# Altium schematic sheet Sensor.SchDoc
size A3; SheetNumber: 7; SheetTotal: 7
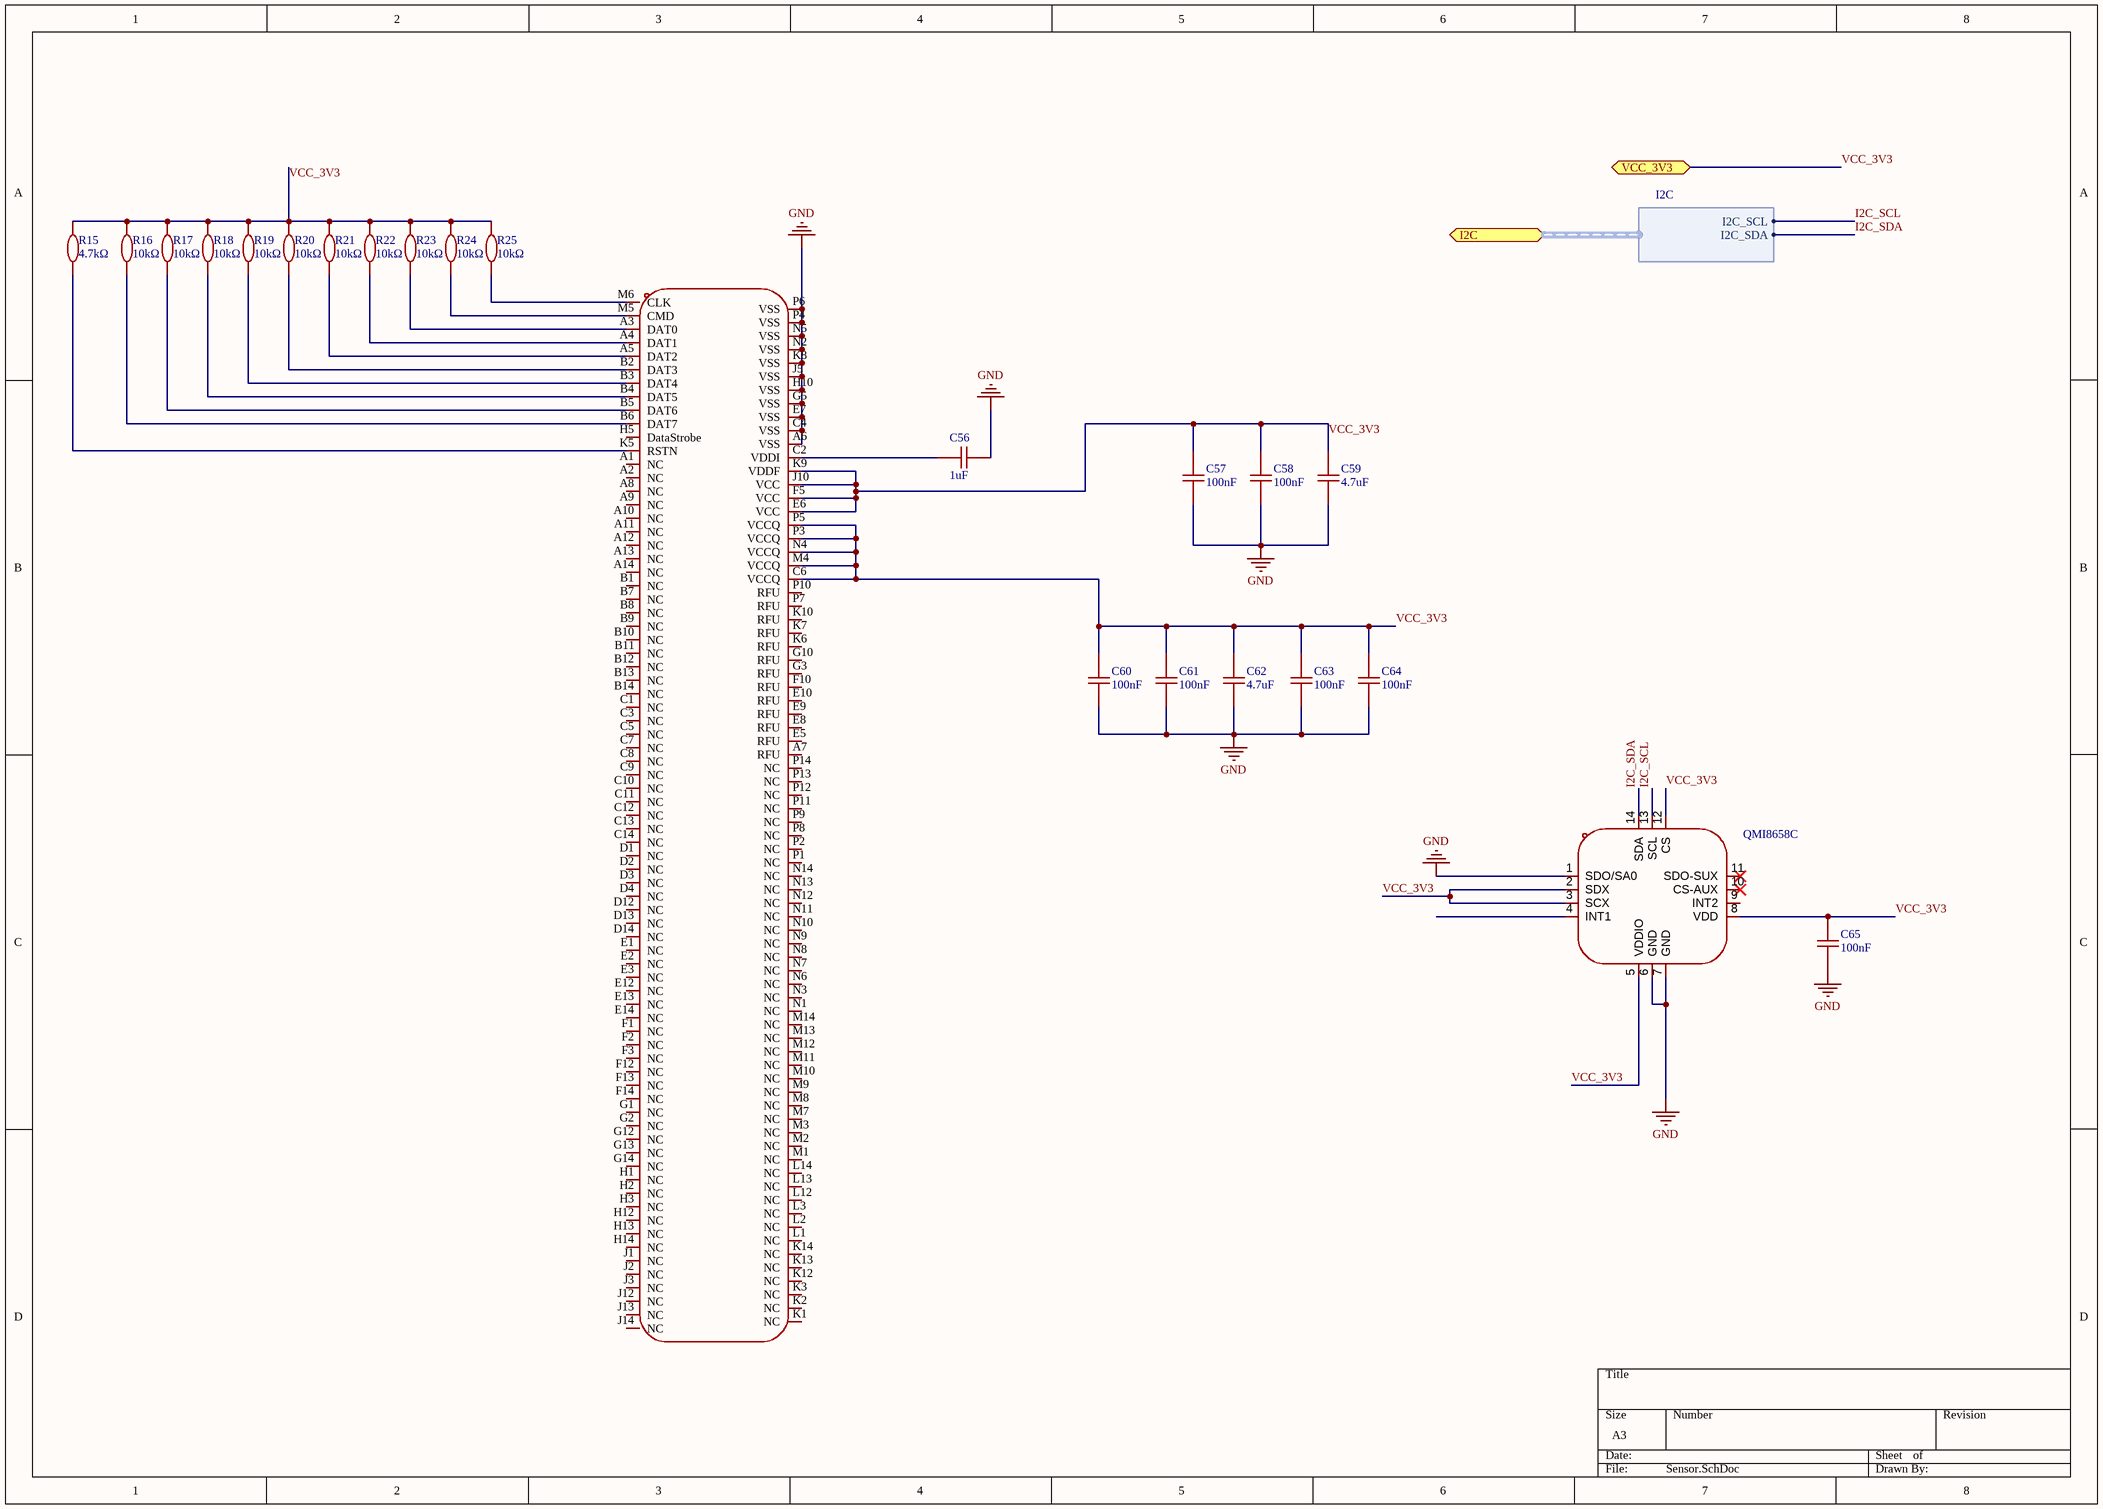
[diagram p0: Sensor.SchDoc]

## Parts
C56  1uF  [C0402]
C57  100nF  [C0402]
C58  100nF  [C0402]
C59  4.7uF  [C0402]
C60  100nF  [C0402]
C61  100nF  [C0402]
C62  4.7uF  [C0402]
C63  100nF  [C0402]
C64  100nF  [C0402]
C65  100nF  [C0402]
R15  4.7kΩ  [R0402]
R16  10kΩ  [R0402]
R17  10kΩ  [R0402]
R18  10kΩ  [R0402]
R19  10kΩ  [R0402]
R20  10kΩ  [R0402]
R21  10kΩ  [R0402]
R22  10kΩ  [R0402]
R23  10kΩ  [R0402]
R24  10kΩ  [R0402]
R25  10kΩ  [R0402]
U10  QMI8658C  [LGA-14_L3.0-W2.5-P0.50-BR]
U11  KLM8G1GETF-B041  [FBGA-153_L13.0-W11.5-P0.50_KLMAG1JETD-B041]  (value not drawn)

## Ports
I2C (bidir, harness I2C), VCC_3V3 (bidir)

## Harnesses
I2C: I2C_SCL, I2C_SDA

## Nets
GND: C56.2 C57.1 C58.1 C59.1 C60.1 C61.1 C62.1 C63.1 C64.1 C65.1 U10.1(SDO/SA0) U10.6(GND) U10.7(GND) U11.A6(VSS) U11.C4(VSS) U11.E7(VSS) U11.G5(VSS) U11.H10(VSS) U11.J5(VSS) U11.K8(VSS) U11.N2(VSS) U11.N5(VSS) U11.P4(VSS) U11.P6(VSS)
I2C_SCL: U10.13(SCL) ; port I2C.I2C_SCL
I2C_SDA: U10.14(SDA) ; port I2C.I2C_SDA
VCC_3V3: C57.2 C58.2 C59.2 C60.2 C61.2 C62.2 C63.2 C64.2 C65.2 R15.2 R16.2 R17.2 R18.2 R19.2 R20.2 R21.2 R22.2 R23.2 R24.2 R25.2 U10.2(SDX) U10.3(SCX) U10.5(VDDIO) U10.8(VDD) U10.12(CS) U11.C6(VCCQ) U11.E6(VCC) U11.F5(VCC) U11.J10(VCC) U11.K9(VDDF) U11.M4(VCCQ) U11.N4(VCCQ) U11.P3(VCCQ) U11.P5(VCCQ) ; port VCC_3V3
NetC56_1: C56.1 U11.C2(VDDI)
NetR15_1: R15.1 U11.K5(RSTN)
NetR16_1: R16.1 U11.B6(DAT7)
NetR17_1: R17.1 U11.B5(DAT6)
NetR18_1: R18.1 U11.B4(DAT5)
NetR19_1: R19.1 U11.B3(DAT4)
NetR20_1: R20.1 U11.B2(DAT3)
NetR21_1: R21.1 U11.A5(DAT2)
NetR22_1: R22.1 U11.A4(DAT1)
NetR23_1: R23.1 U11.A3(DAT0)
NetR24_1: R24.1 U11.M5(CMD)
NetR25_1: R25.1 U11.M6(CLK)

Not connected (* = marked no-connect by the designer): U10 4(INT1) 9(INT2) 10(CS-AUX)* 11(SDO-SUX)*; U11 A1(NC) A2(NC) A7(RFU) A8(NC) A9(NC) A10(NC) A11(NC) A12(NC) A13(NC) A14(NC) B1(NC) B7(NC) B8(NC) B9(NC) B10(NC) B11(NC) B12(NC) B13(NC) B14(NC) C1(NC) C3(NC) C5(NC) C7(NC) C8(NC) C9(NC) C10(NC) C11(NC) C12(NC) C13(NC) C14(NC) D1(NC) D2(NC) D3(NC) D4(NC) D12(NC) D13(NC) D14(NC) E1(NC) E2(NC) E3(NC) E5(RFU) E8(RFU) E9(RFU) E10(RFU) E12(NC) E13(NC) E14(NC) F1(NC) F2(NC) F3(NC) F10(RFU) F12(NC) F13(NC) F14(NC) G1(NC) G2(NC) G3(RFU) G10(RFU) G12(NC) G13(NC) G14(NC) H1(NC) H2(NC) H3(NC) H5(DataStrobe) H12(NC) H13(NC) H14(NC) J1(NC) J2(NC) J3(NC) J12(NC) J13(NC) J14(NC) K1(NC) K2(NC) K3(NC) K6(RFU) K7(RFU) K10(RFU) K12(NC) K13(NC) K14(NC) L1(NC) L2(NC) L3(NC) L12(NC) L13(NC) L14(NC) M1(NC) M2(NC) M3(NC) M7(NC) M8(NC) M9(NC) M10(NC) M11(NC) M12(NC) M13(NC) M14(NC) N1(NC) N3(NC) N6(NC) N7(NC) N8(NC) N9(NC) N10(NC) N11(NC) N12(NC) N13(NC) N14(NC) P1(NC) P2(NC) P7(RFU) P8(NC) P9(NC) P10(RFU) P11(NC) P12(NC) P13(NC) P14(NC)

## Library data of the parts
C56 = 1uF: 50V 1uF X5R ±10% 0402 Ceramic Capacitors ROHS
C57 C58 C60 C61 C63-C65 = 100nF: 50V 100nF X7R ±10% 0402 Ceramic Capacitors ROHS
C59 C62 = 4.7uF: 10V 4.7uF X5R ±20% 0402 Ceramic Capacitors ROHS
R15-R25 = 10kΩ: 62.5mW 10kΩ 50V ±100ppm/℃ Thick Film Resistor ±1% 0402 Chip Resistor - Surface Mount ROHS
U10 = QMI8658C: 低噪声、宽带宽6D惯性测量单元，带运动协处理器和传感器融合功能; Symbol: QMI8658C
U11 = KLM8G1GETF-B041_1: 8GB 2.7V~3.6V eMMC 5.1 330/50 MB/s FBGA-153(11.5x13) Memory (ICs) ROHS; Manufacturer: SAMSUNG(三星半导体); Add into BOM: yes; Reading Speed in Sequence: 330MB/S; Writing Speed in Sequence: 50MB/S; Controller Operating Voltage (VCCQ): 2.7V~3.6V；1.7V~1.95V; Symbol: KLM8G1GETF-B041; Device: KLM8G1GETF-B041; LCSC Part Name: KLM8G1GETF-B041; Supplier Part: C499918; Manufacturer Part: KLM8G1GETF-B041; Supplier Footprint: FBGA-153(11.5x13); JLCPCB Part Class: Extended Part; Datasheet: https://item.szlcsc.com/datasheet/KLM8G1GETF-B041/512098.html; Supplier: LCSC; Convert to PCB: yes; configuration: -; Interface: eMMC 5.1; Voltage - Supply: 2.7V~3.6V; Operating Temperature: -25℃~+85℃; Sequential Read/Write (MB/s): 330/50 MB/s; Random Read/Write (IOPS): -; Memory Size: 8GB; NAND Operating Voltage (VCCF): 2.7V~3.6V